# Altium project MOWER_BDC.PRJPCB
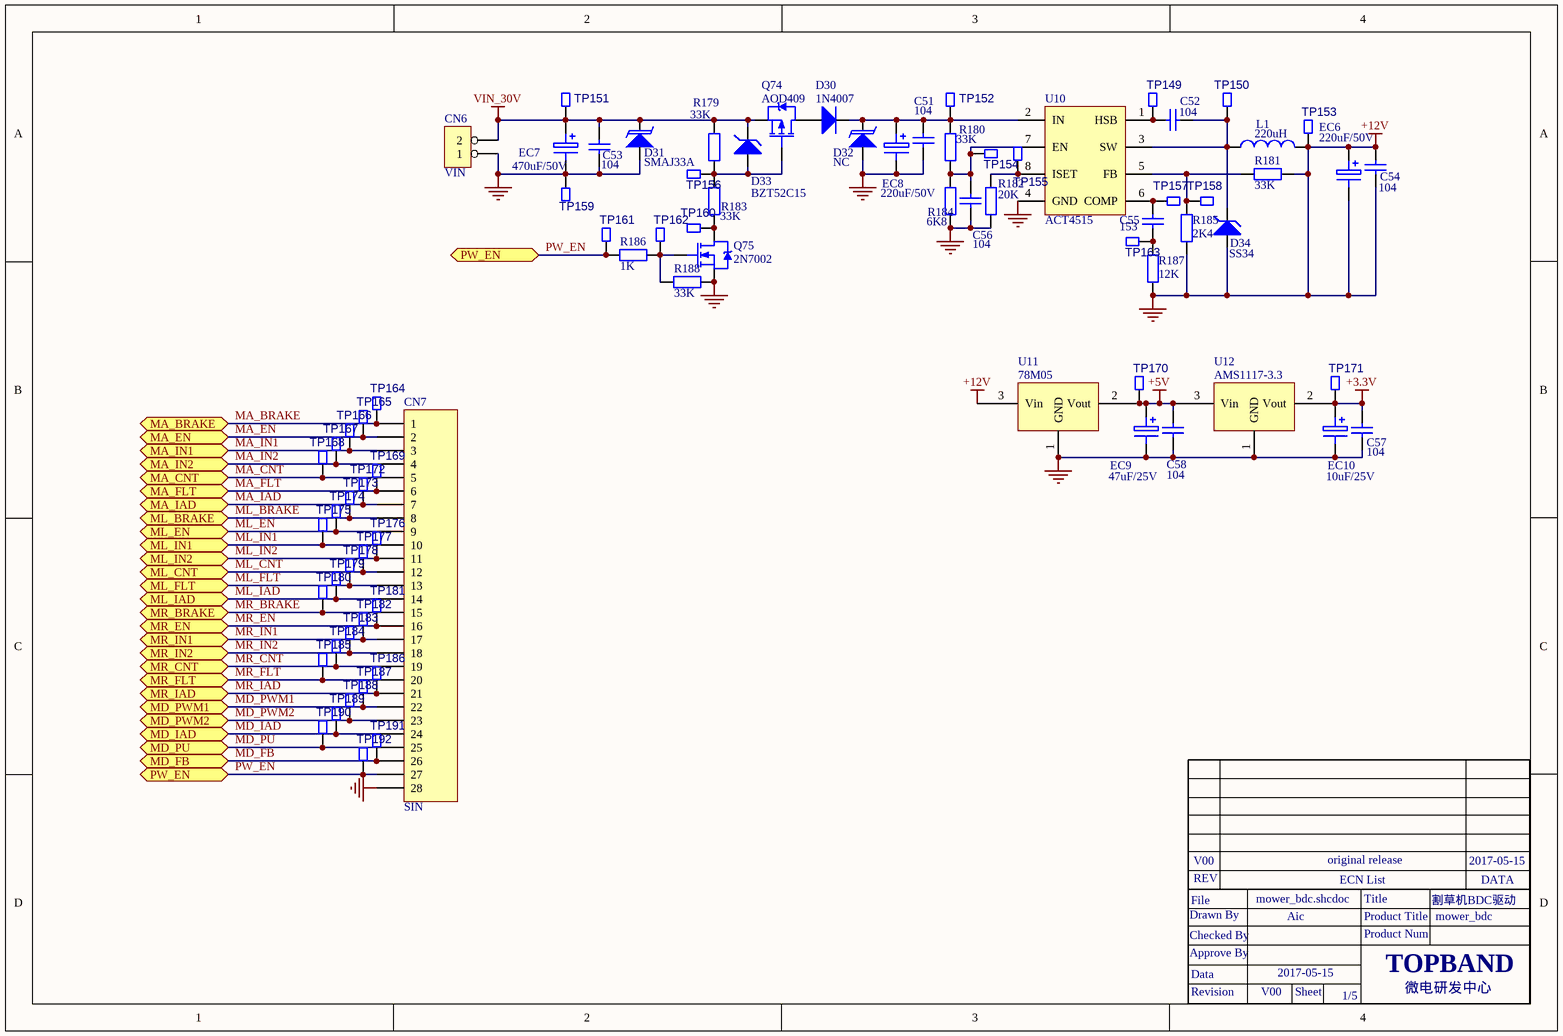
[diagram p0: mower_bdc.SchDoc]
5 sheets, 583 parts. Net scope: flat (ports and power ports of the same name join across sheets).
Sheets:
  mower_bdc.SchDoc
  mc_ma.SchDoc
  mc_wl.SchDoc
  mc_wr.SchDoc
  mc_ds.SchDoc

## Sheet mower_bdc.SchDoc
size A4

### Parts
C51  104  [0603C]
C52  104  [0603C]
C53  104  [0805C]
C54  104  [0603C]
C55  153  [0603C]
C56  104  [0603C]
C57  104  [0603C]
C58  104  [0603C]
CN6  VIN  [CON2-3.96]
CN7  SIN  [CON2.54-2*14]
D30  1N4007  [SMA]
D31  SMAJ33A  [DO-214AC]
D32  NC  [SOD-123]
D33  BZT52C15  [SOD-123]
D34  SS34  [SMA]
EC6  220uF/50V  [EC10]
EC7  470uF/50V  [EC12.5]
EC8  220uF/50V  [EC10]
EC9  47uF/25V  [EC5]
EC10  10uF/25V  [EC4]
L1  220uH  [150700618]
Q74  AOD409  [D-PACK-GDS]
Q75  2N7002  [SOT23-GDS]
R179  33K  [0603R]
R180  33K  [0603R]
R181  33K  [0603R]
R182  20K  [0603R]
R183  33K  [0603R]
R184  6K8  [0603R]
R185  2K4  [0603R]
R186  1K  [0603R]
R187  12K  [0603R]
R188  33K  [0603R]
TP149  TP  [TEST-0.8MM]  (value not drawn)
TP150  TP  [TEST-0.8MM]  (value not drawn)
TP151  TP  [TEST-0.8MM]  (value not drawn)
TP152  TP  [TEST-0.8MM]  (value not drawn)
TP153  TP  [TEST-0.8MM]  (value not drawn)
TP154  TP  [TEST-0.8MM]  (value not drawn)
TP155  TP  [TEST-0.8MM]  (value not drawn)
TP156  TP  [TEST-0.8MM]  (value not drawn)
TP157  TP  [TEST-0.8MM]  (value not drawn)
TP158  TP  [TEST-0.8MM]  (value not drawn)
TP159  TP  [TEST-0.8MM]  (value not drawn)
TP160  TP  [TEST-0.8MM]  (value not drawn)
TP161  TP  [TEST-0.8MM]  (value not drawn)
TP162  TP  [TEST-0.8MM]  (value not drawn)
TP163  TP  [TEST-0.8MM]  (value not drawn)
TP164  TP  [TEST-0.8MM]  (value not drawn)
TP165  TP  [TEST-0.8MM]  (value not drawn)
TP166  TP  [TEST-0.8MM]  (value not drawn)
TP167  TP  [TEST-0.8MM]  (value not drawn)
TP168  TP  [TEST-0.8MM]  (value not drawn)
TP169  TP  [TEST-0.8MM]  (value not drawn)
TP170  TP  [TEST-0.8MM]  (value not drawn)
TP171  TP  [TEST-0.8MM]  (value not drawn)
TP172  TP  [TEST-0.8MM]  (value not drawn)
TP173  TP  [TEST-0.8MM]  (value not drawn)
TP174  TP  [TEST-0.8MM]  (value not drawn)
TP175  TP  [TEST-0.8MM]  (value not drawn)
TP176  TP  [TEST-0.8MM]  (value not drawn)
TP177  TP  [TEST-0.8MM]  (value not drawn)
TP178  TP  [TEST-0.8MM]  (value not drawn)
TP179  TP  [TEST-0.8MM]  (value not drawn)
TP180  TP  [TEST-0.8MM]  (value not drawn)
TP181  TP  [TEST-0.8MM]  (value not drawn)
TP182  TP  [TEST-0.8MM]  (value not drawn)
TP183  TP  [TEST-0.8MM]  (value not drawn)
TP184  TP  [TEST-0.8MM]  (value not drawn)
TP185  TP  [TEST-0.8MM]  (value not drawn)
TP186  TP  [TEST-0.8MM]  (value not drawn)
TP187  TP  [TEST-0.8MM]  (value not drawn)
TP188  TP  [TEST-0.8MM]  (value not drawn)
TP189  TP  [TEST-0.8MM]  (value not drawn)
TP190  TP  [TEST-0.8MM]  (value not drawn)
TP191  TP  [TEST-0.8MM]  (value not drawn)
TP192  TP  [TEST-0.8MM]  (value not drawn)
U10  ACT4515  [SOP-8]
U11  78M05  [D-PACK]
U12  AMS1117-3.3  [SOT-223]

### Ports
MA_BRAKE, MA_CNT, MA_EN, MA_FLT, MA_IAD, MA_IN1, MA_IN2, MD_FB, MD_IAD, MD_PU, MD_PWM1, MD_PWM2, ML_BRAKE, ML_CNT, ML_EN, ML_FLT, ML_IAD, ML_IN1, ML_IN2, MR_BRAKE, MR_CNT, MR_EN, MR_FLT, MR_IAD, MR_IN1, MR_IN2, PW_EN

### Nets
+3.3V: C57.1 EC10.1 TP171.1 U12.2(Vout)
+5V: C58.1 EC9.1 TP170.1 U11.2(Vout) U12.3(Vin)
+12V: C51.2 C53.1 C54.1 C54.2 C56.2 C57.2 C58.2 CN6.1 CN7.28 D31.A D32.A D34.A EC6.1 EC6.2 EC7.2 EC8.2 EC9.2 EC10.2 L1.2 Q75.S R181.1 R182.2 R184.2 R185.1 R187.1 R188.2 TP153.1 TP159.1 U10.4(GND) U11.1(GND) U11.3(Vin) U12.1(GND)  [also labelled GND]
VIN_30V: C53.2 CN6.2 D31.K D33.K EC7.1 Q74.S R179.2 TP151.1
MA_BRAKE: CN7.1 TP164.1 ; port MA_BRAKE
MA_CNT: CN7.5 TP168.1 ; port MA_CNT
MA_EN: CN7.2 TP165.1 ; port MA_EN
MA_FLT: CN7.6 TP169.1 ; port MA_FLT
MA_IAD: CN7.7 TP172.1 ; port MA_IAD
MA_IN1: CN7.3 TP166.1 ; port MA_IN1
MA_IN2: CN7.4 TP167.1 ; port MA_IN2
MD_FB: CN7.26 TP191.1 ; port MD_FB
MD_IAD: CN7.24 TP189.1 ; port MD_IAD
MD_PU: CN7.25 TP190.1 ; port MD_PU
MD_PWM1: CN7.22 TP187.1 ; port MD_PWM1
MD_PWM2: CN7.23 TP188.1 ; port MD_PWM2
ML_BRAKE: CN7.8 TP173.1 ; port ML_BRAKE
ML_CNT: CN7.12 TP177.1 ; port ML_CNT
ML_EN: CN7.9 TP174.1 ; port ML_EN
ML_FLT: CN7.13 TP178.1 ; port ML_FLT
ML_IAD: CN7.14 TP179.1 ; port ML_IAD
ML_IN1: CN7.10 TP175.1 ; port ML_IN1
ML_IN2: CN7.11 TP176.1 ; port ML_IN2
MR_BRAKE: CN7.15 TP180.1 ; port MR_BRAKE
MR_CNT: CN7.19 TP184.1 ; port MR_CNT
MR_EN: CN7.16 TP181.1 ; port MR_EN
MR_FLT: CN7.20 TP185.1 ; port MR_FLT
MR_IAD: CN7.21 TP186.1 ; port MR_IAD
MR_IN1: CN7.17 TP182.1 ; port MR_IN1
MR_IN2: CN7.18 TP183.1 ; port MR_IN2
PW_EN: CN7.27 R186.1 TP161.1 TP192.1 ; port PW_EN
NetC51_1: C51.1 D30.K D32.K EC8.1 R180.1 TP152.1 U10.2(IN)
NetC52_1: C52.1 TP149.1 U10.1(HSB)
NetC52_2: C52.2 D34.K L1.1 TP150.1 U10.3(SW)
NetC55_1: C55.1 TP157.1 U10.6(COMP)
NetC55_2: C55.2 R187.2 TP163.1
NetC56_1: C56.1 R180.2 R184.1 TP154.1 U10.7(EN)
NetD30_A: D30.A Q74.D
NetD33_A: D33.A Q74.G R179.1 R183.1 TP156.1
NetQ75_D: Q75.D R183.2 TP160.1
NetQ75_G: Q75.G R186.2 R188.1 TP162.1
NetR181_2: R181.2 R185.2 TP158.1 U10.5(FB)
NetR182_1: R182.1 TP155.1 U10.8(ISET)

### Notes on the sheet
- Drawn By
- File
- REV
- V00
- mower_bdc.shcdoc
- Aic
- original release
- ECN List
- Product Title
- Title
- 割草机BDC驱动
- mower_bdc
- 2017-05-15
- DATA
- Approve By
- Checked By
- Data
- Product Num
- TOPBAND
- Revision
- Sheet
- 1/5
- 微电研发中心

### Library data of the parts
C51-C58 = Cap(0603): Component Kind: standard; Component Type: standard
CN6 = 2Pin(卧式): 插座; U_TABLE: U_SAM01021601; id: 20; Part Number: 2Pin(卧式); Component Kind: Standard; Component Type: Standard; Designator: 2Pin(卧式); Footprint: CON2-2.54卧式; Pin Count: 2
CN7 = CON28
D30 = Diode(DO-35)-D: 二极管; U_TABLE: U_SAM010203; id: 32; Part Number: Diode(DO-35)-D; Component Kind: standard; Component Type: standard; Pin Count: 2
D31 = Diode(TVS_贴片)_1: 120301346; U_TABLE: U_SAM010203; id: 28; Description: TVS管; Part Number: Diode(TVS_贴片)_1; Component Kind: standard; Component Type: standard; Pin Count: 2
D32 = Diode(TVS_贴片)_1: TVS管; U_TABLE: U_SAM010203; id: 28; Part Number: Diode(TVS_贴片)_1; Component Kind: standard; Component Type: standard; Pin Count: 2
D33 D34 = D Zener(贴片): 120301465; U_TABLE: U_SAM010203; id: 25; Description: 稳压二极管; Part Number: D Zener(贴片); Component Kind: standard; Component Type: standard; Pin Count: 2
EC6 EC8-EC10 = Electro(2.5mm): 电解电容; U_TABLE: U_SAM010202; id: 42; Part Number: Electro(2.5mm); Component Kind: standard; Component Type: standard; Pin Count: 2
EC7 = Electro(2.5mm): 150200079; U_TABLE: U_SAM010202; id: 42; Description: 电解电容; Part Number: Electro(2.5mm); Component Kind: standard; Component Type: standard; Pin Count: 2
L1 = Inductor(0805): 150700618; U_TABLE: U_SAM010207; id: 140; Description: 电感; Part Number: Inductor(0805); Component Kind: standard; Component Type: standard
Q74 = PMOS-2: MOS管; U_TABLE: U_SAM010204; id: 19; Part Number: PMOS-2; Component Kind: standard; Component Type: standard; Pin Count: 3
Q75 = NMOS-2: MOS管; U_TABLE: U_SAM010204; id: 17; Part Number: NMOS-2; Component Kind: standard; Component Type: standard; Pin Count: 3
R179-R185 R187 R188 = Res2: Resistor; Value: 1K; 物料编码: 150103083; Published: 8-Jun-2000; LatestRevisionDate: 17-Jul-2002; LatestRevisionNote: Re-released for DXP Platform.; PackageReference: AXIAL-0.4; Publisher: Altium Limited
R186 = Res2: Resistor; 物料编码: 150103083; Published: 8-Jun-2000; LatestRevisionDate: 17-Jul-2002; LatestRevisionNote: Re-released for DXP Platform.; PackageReference: AXIAL-0.4; Publisher: Altium Limited; Value: 1K
U11 = AMS1117-3.3

## Sheet mc_ma.SchDoc
size A4
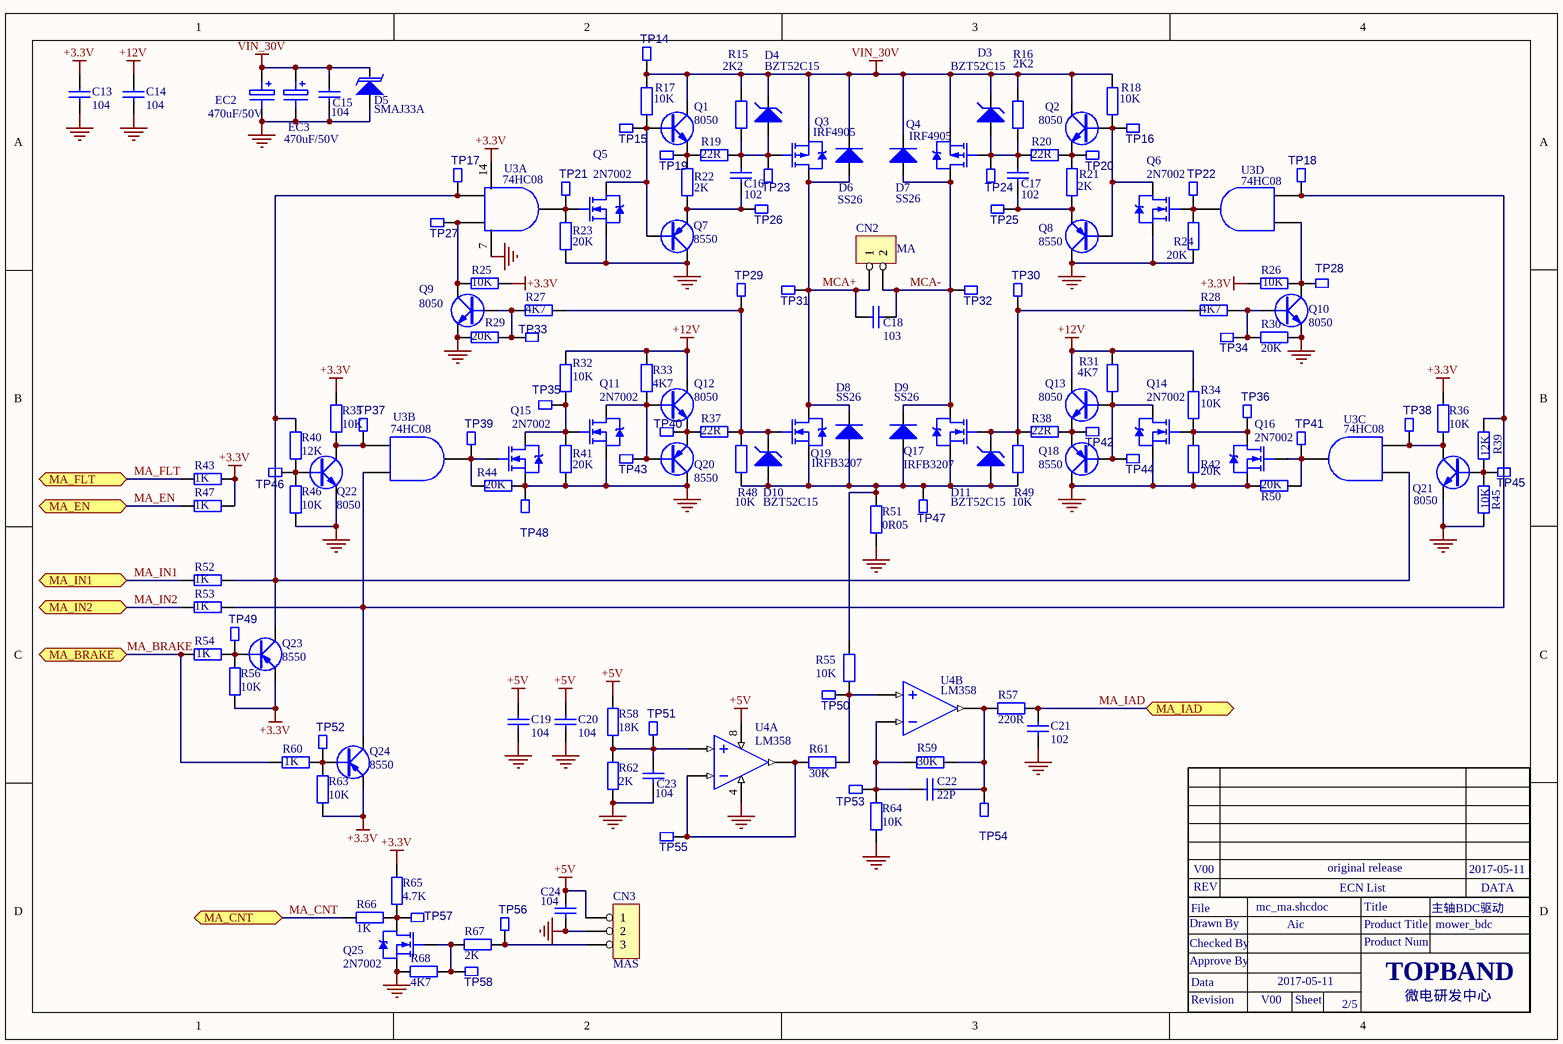
[diagram p1: mc_ma.SchDoc]

### Parts
C13  104  [0603C]
C14  104  [0603C]
C15  104  [0805C]
C16  102  [0805C]
C17  102  [0805C]
C18  103  [1206C]
C19  104  [0603C]
C20  104  [0603C]
C21  102  [0603C]
C22  22P  [0603C]
C23  104  [0603C]
C24  104  [0603C]
CN2  MA  [CON2-3.96]
CN3  MAS  [CON3-2.54]
D3  BZT52C15  [SOD-123]
D4  BZT52C15  [SOD-123]
D5  SMAJ33A  [DO-214AC]
D6  SS26  [SMB]
D7  SS26  [SMB]
D8  SS26  [SMB]
D9  SS26  [SMB]
D10  BZT52C15  [SOD-123]
D11  BZT52C15  [SOD-123]
EC2  470uF/50V  [EC12.5]
EC3  470uF/50V  [EC12.5]
Q1  8050  [SOT-23-BCE]
Q2  8050  [SOT-23-BCE]
Q3  IRF4905  [TO-220-GDS]
Q4  IRF4905  [TO-220-GDS]
Q5  2N7002  [SOT-23-GDS]
Q6  2N7002  [SOT-23-GDS]
Q7  8550  [SOT-23-BCE]
Q8  8550  [SOT-23-BCE]
Q9  8050  [SOT-23-BCE]
Q10  8050  [SOT-23-BCE]
Q11  2N7002  [SOT-23-GDS]
Q12  8050  [SOT-23-BCE]
Q13  8050  [SOT-23-BCE]
Q14  2N7002  [SOT-23-GDS]
Q15  2N7002  [SOT-23-GDS]
Q16  2N7002  [SOT-23-GDS]
Q17  IRFB3207  [TO-220-GDS]
Q18  8550  [SOT-23-BCE]
Q19  IRFB3207  [TO-220-GDS]
Q20  8550  [SOT-23-BCE]
Q21  8050  [SOT-23-BCE]
Q22  8050  [SOT-23-BCE]
Q23  8550  [SOT-23-BCE]
Q24  8550  [SOT-23-BCE]
Q25  2N7002  [SOT-23-GDS]
R15  2K2  [0805R]
R16  2K2  [0805R]
R17  10K  [0603R]
R18  10K  [0603R]
R19  22R  [0805R]
R20  22R  [0805R]
R21  2K  [0805R]
R22  2K  [0805R]
R23  20K  [0603R]
R24  20K  [0603R]
R25  10K  [0603R]
R26  10K  [0603R]
R27  4K7  [0603R]
R28  4K7  [0603R]
R29  20K  [0603R]
R30  20K  [0603R]
R31  4K7  [0603R]
R32  10K  [0603R]
R33  4K7  [0603R]
R34  10K  [0603R]
R35  10K  [0603R]
R36  10K  [0603R]
R37  22R  [0805R]
R38  22R  [0805R]
R39  12K  [0603R]
R40  12K  [0603R]
R41  20K  [0603R]
R42  20K  [0603R]
R43  1K  [0603R]
R44  20K  [0603R]
R45  10K  [0603R]
R46  10K  [0603R]
R47  1K  [0603R]
R48  10K  [0603R]
R49  10K  [0603R]
R50  20K  [0603R]
R51  0R05  [2512R]
R52  1K  [0603R]
R53  1K  [0603R]
R54  1K  [0603R]
R55  10K  [0603R]
R56  10K  [0603R]
R57  220R  [0603R]
R58  18K  [0603R]
R59  30K  [0603R]
R60  1K  [0603R]
R61  30K  [0603R]
R62  2K  [0603R]
R63  10K  [0603R]
R64  10K  [0603R]
R65  4.7K  [0603R]
R66  1K  [0603R]
R67  2K  [0603R]
R68  4K7  [0603R]
TP14  TP  [TEST-0.8MM]  (value not drawn)
TP15  TP  [TEST-0.8MM]  (value not drawn)
TP16  TP  [TEST-0.8MM]  (value not drawn)
TP17  TP  [TEST-0.8MM]  (value not drawn)
TP18  TP  [TEST-0.8MM]  (value not drawn)
TP19  TP  [TEST-0.8MM]  (value not drawn)
TP20  TP  [TEST-0.8MM]  (value not drawn)
TP21  TP  [TEST-0.8MM]  (value not drawn)
TP22  TP  [TEST-0.8MM]  (value not drawn)
TP23  TP  [TEST-0.8MM]  (value not drawn)
TP24  TP  [TEST-0.8MM]  (value not drawn)
TP25  TP  [TEST-0.8MM]  (value not drawn)
TP26  TP  [TEST-0.8MM]  (value not drawn)
TP27  TP  [TEST-0.8MM]  (value not drawn)
TP28  TP  [TEST-0.8MM]  (value not drawn)
TP29  TP  [TEST-0.8MM]  (value not drawn)
TP30  TP  [TEST-0.8MM]  (value not drawn)
TP31  TP  [TEST-0.8MM]  (value not drawn)
TP32  TP  [TEST-0.8MM]  (value not drawn)
TP33  TP  [TEST-0.8MM]  (value not drawn)
TP34  TP  [TEST-0.8MM]  (value not drawn)
TP35  TP  [TEST-0.8MM]  (value not drawn)
TP36  TP  [TEST-0.8MM]  (value not drawn)
TP37  TP  [TEST-0.8MM]  (value not drawn)
TP38  TP  [TEST-0.8MM]  (value not drawn)
TP39  TP  [TEST-0.8MM]  (value not drawn)
TP40  TP  [TEST-0.8MM]  (value not drawn)
TP41  TP  [TEST-0.8MM]  (value not drawn)
TP42  TP  [TEST-0.8MM]  (value not drawn)
TP43  TP  [TEST-0.8MM]  (value not drawn)
TP44  TP  [TEST-0.8MM]  (value not drawn)
TP45  TP  [TEST-0.8MM]  (value not drawn)
TP46  TP  [TEST-0.8MM]  (value not drawn)
TP47  TP  [TEST-0.8MM]  (value not drawn)
TP48  TP  [TEST-0.8MM]  (value not drawn)
TP49  TP  [TEST-0.8MM]  (value not drawn)
TP50  TP  [TEST-0.8MM]  (value not drawn)
TP51  TP  [TEST-0.8MM]  (value not drawn)
TP52  TP  [TEST-0.8MM]  (value not drawn)
TP53  TP  [TEST-0.8MM]  (value not drawn)
TP54  TP  [TEST-0.8MM]  (value not drawn)
TP55  TP  [TEST-0.8MM]  (value not drawn)
TP56  TP  [TEST-0.8MM]  (value not drawn)
TP57  TP  [TEST-0.8MM]  (value not drawn)
TP58  TP  [TEST-0.8MM]  (value not drawn)
U3  74HC08  [SO-14]  (parts A,B,C,D of 4)
U4  LM358  [SO-8]  (parts A,B of 2)

### Ports
MA_BRAKE, MA_CNT, MA_EN, MA_FLT, MA_IAD, MA_IN1, MA_IN2

### Nets
+3.3V: C13.2 Q23.E Q24.E R25.2 R26.1 R35.1 R36.2 R43.2 R47.2 R56.2 R63.2 R65.2 U3.14(VCC)
+5V: C19.2 C20.2 C24.2 CN3.1 R58.2 U4.8(VCC)
+12V: C13.1 C14.1 C14.2 C15.1 C19.1 C20.1 C21.2 C23.1 C24.1 CN3.2 D5.A EC2.2 EC3.2 Q5.S Q6.S Q7.C Q8.C Q9.E Q10.E Q11.S Q12.C Q13.C Q14.S Q15.S Q16.S Q18.C Q20.C Q21.E Q22.E Q25.S R23.2 R24.1 R29.1 R30.2 R31.1 R32.2 R33.2 R34.2 R41.2 R42.2 R44.2 R45.1 R46.1 R50.1 R51.1 R62.1 R64.1 R68.1 TP48.1 U3.7(GND) U4.4(GND)  [also labelled GND]
VIN_30V: C15.2 D3.K D4.K D5.K D6.K D7.K EC2.1 EC3.1 Q1.C Q2.C Q3.S Q4.S R15.1 R16.1 R17.1 R18.1 TP14.1
MA_BRAKE: R54.2 R60.2 ; port MA_BRAKE
MA_CNT: R66.1 ; port MA_CNT
MA_EN: R47.1 ; port MA_EN
MA_FLT: R43.1 ; port MA_FLT
MA_IAD: C21.1 R57.2 ; port MA_IAD
MA_IN1: R52.1 ; port MA_IN1
MA_IN2: R53.1 ; port MA_IN2
MCA+: C18.1 CN2.1 D6.A D8.K Q3.D Q19.D TP31.1
MCA-: C18.2 CN2.2 D7.A D9.K Q4.D Q17.D TP32.1
NetC16_1: C16.1 D4.A Q3.G R15.2 R19.2 TP23.1
NetC16_2: C16.2 Q7.E R22.2 TP26.1
NetC17_1: C17.1 D3.A Q4.G R16.2 R20.1 TP24.1
NetC17_2: C17.2 Q8.E R21.2 TP25.1
NetC22_1: C22.1 R57.1 R59.1 TP54.1 U4.1(OUT2)
NetC22_2: C22.2 R59.2 R64.2 TP53.1 U4.2(-IN2)
NetC23_2: C23.2 R58.1 R62.2 TP51.1 U4.5(+IN1)
NetCN3_3: CN3.3 R67.1 TP56.1
NetD8_A: D8.A D9.A D10.A D11.A Q17.S Q19.S R48.1 R49.1 R51.2 R55.1 TP47.1
NetD10_K: D10.K Q19.G R27.2 R37.2 R48.2 TP29.1
NetD11_K: D11.K Q17.G R28.1 R38.1 R49.2 TP30.1
NetQ1_B: Q1.B Q5.D Q7.B R17.2 TP15.1
NetQ1_E: Q1.E R19.1 R22.1 TP19.1
NetQ2_B: Q2.B Q6.D Q8.B R18.2 TP16.1
NetQ2_E: Q2.E R20.2 R21.1 TP20.1
NetQ5_G: Q5.G R23.1 TP21.1 U3.3(1Y)
NetQ6_G: Q6.G R24.2 TP22.1 U3.11(4Y)
NetQ9_B: Q9.B R27.1 R29.2 TP33.1
NetQ9_C: Q9.C R25.1 TP27.1 U3.2(1B)
NetQ10_B: Q10.B R28.2 R30.1 TP34.1
NetQ10_C: Q10.C R26.2 TP28.1 U3.12(4A)
NetQ11_D: Q11.D Q12.B Q20.B R33.1 TP43.1
NetQ11_G: Q11.G Q15.D R32.1 R41.1 TP35.1
NetQ12_E: Q12.E Q20.E R37.1 TP40.1
NetQ13_B: Q13.B Q14.D Q18.B R31.2 TP44.1
NetQ13_E: Q13.E Q18.E R38.2 TP42.1
NetQ14_G: Q14.G Q16.D R34.1 R42.1 TP36.1
NetQ15_G: Q15.G R44.1 TP39.1 U3.6(2Y)
NetQ16_G: Q16.G R50.2 TP41.1 U3.8(3Y)
NetQ21_B: Q21.B R39.1 R45.2 TP45.1
NetQ21_C: Q21.C R36.1 TP38.1 U3.10(3B)
NetQ22_B: Q22.B R40.2 R46.2 TP46.1
NetQ22_C: Q22.C R35.2 TP37.1 U3.4(2A)
NetQ23_B: Q23.B R54.1 R56.1 TP49.1
NetQ23_C: Q23.C R40.1 R52.2 TP17.1 U3.1(1A) U3.9(3A)
NetQ24_B: Q24.B R60.1 R63.1 TP52.1
NetQ24_C: Q24.C R39.2 R53.2 TP18.1 U3.5(2B) U3.13(4B)
NetQ25_D: Q25.D R65.1 R66.2 TP57.1
NetQ25_G: Q25.G R67.2 R68.2 TP58.1
NetR55_2: R55.2 R61.2 TP50.1 U4.3(IN2+)
NetR61_1: R61.1 TP55.1 U4.6(-IN1) U4.7(OUT1)

### Notes on the sheet
- Drawn By
- File
- REV
- V00
- mc_ma.shcdoc
- Aic
- original release
- ECN List
- Product Title
- Title
- 主轴BDC驱动
- mower_bdc
- 2017-05-11
- DATA
- Approve By
- Checked By
- Data
- Product Num
- TOPBAND
- Revision
- Sheet
- 2/5
- 微电研发中心

### Library data of the parts
C13-C24 = Cap(0603): Component Kind: standard; Component Type: standard
CN2 = 2Pin(卧式): 插座; U_TABLE: U_SAM01021601; id: 20; Part Number: 2Pin(卧式); Component Kind: Standard; Component Type: Standard; Designator: 2Pin(卧式); Footprint: CON2-2.54卧式; Pin Count: 2
CN3 = 3Pin(卧式): 插座; U_TABLE: U_SAM01021601; id: 26; Part Number: 3Pin(卧式); Component Kind: standard; Component Type: standard; Designator: 3Pin(卧式); Footprint: CON3-2.54卧式; Pin Count: 3
D3 D4 D10 D11 = D Zener(贴片): 120301303; U_TABLE: U_SAM010203; id: 25; Description: 稳压二极管; Part Number: D Zener(贴片); Component Kind: standard; Component Type: standard; Pin Count: 2
D5 = Diode(TVS_贴片)_1: as D31 on sheet mower_bdc; Part Number: Diode(TVS_贴片)_1; Component Kind: standard; Component Type: standard; Pin Count: 2
D6-D9 = Diode(DO-35)-D: 二极管; U_TABLE: U_SAM010203; id: 32; Part Number: Diode(DO-35)-D; Component Kind: standard; Component Type: standard; Pin Count: 2
EC2 EC3 = Electro(2.5mm): as EC7 on sheet mower_bdc; Part Number: Electro(2.5mm); Component Kind: standard; Component Type: standard; Pin Count: 2
Q1 Q2 Q9 Q10 Q12 Q13 Q21 Q22 = NPN(贴片): 三极管; U_TABLE: U_SAM010204; id: 18; Part Number: NPN(贴片); Component Kind: standard; Component Type: standard; Pin Count: 3
Q3 Q4 = PMOS-2: MOS管; U_TABLE: U_SAM010204; id: 19; Part Number: PMOS-2; Component Kind: standard; Component Type: standard; Pin Count: 3
Q5 Q6 Q11 Q14-Q17 Q19 Q25 = NMOS-2: MOS管; U_TABLE: U_SAM010204; id: 17; Part Number: NMOS-2; Component Kind: standard; Component Type: standard; Pin Count: 3
Q7 Q8 Q18 Q20 Q23 Q24 = PNP(贴片): 三极管; U_TABLE: U_SAM010204; id: 20; Part Number: PNP(贴片); Component Kind: standard; Component Type: standard; Pin Count: 3
R15-R42 R44-R46 R48-R51 R65 = Res2: Resistor; Value: 1K; 物料编码: 150103083; Published: 8-Jun-2000; LatestRevisionDate: 17-Jul-2002; LatestRevisionNote: Re-released for DXP Platform.; PackageReference: AXIAL-0.4; Publisher: Altium Limited
R43 R47 R52-R54 R60 = Res2: Resistor; 物料编码: 150103083; Published: 8-Jun-2000; LatestRevisionDate: 17-Jul-2002; LatestRevisionNote: Re-released for DXP Platform.; PackageReference: AXIAL-0.4; Publisher: Altium Limited; Value: 1K
R55 R57 R59 R61 R64 = Res2: Resistor; Value: 1K; Published: 8-Jun-2000; LatestRevisionDate: 17-Jul-2002; LatestRevisionNote: Re-released for DXP Platform.; PackageReference: AXIAL-0.4; Publisher: Altium Limited
R56 R58 R62 R63 R66-R68 = Res2: Resistor; Published: 8-Jun-2000; LatestRevisionDate: 17-Jul-2002; LatestRevisionNote: Re-released for DXP Platform.; PackageReference: AXIAL-0.4; Publisher: Altium Limited
U4 = IC_LM358: 121000225; U_TABLE: U_SAM010210; Description: 集成电路; id: 83; U_ITEM_ID（物料编码）: 121000100; U_100114（SAP物料描述）: SMT运放LM358_SO-8_TI_环保; U_100047（环保属性）: 环保; U_100107（工厂BOM使用频率）: 1000:1;1500:12;3000:7;5000:14;; U_100105（工厂库存）: 1000:7508.000;1500:160.000;2000:0.000;3000:485.000;5000:1542.000;; U_100117（工厂采购量）: 1000:7500.000;1500:300.000;3000:2500.000;5000:7500.000;; Part Number: IC_LM358; Component Kind: standard; Component Type: standard; Designator: IC_LM358; Footprint: DIP14; Pin Count: 8; U_100076（型号）: LM358; U_100040（封装方式）: SO-8; U_100086（指定供应商）: TI

## Sheet mc_wl.SchDoc
size A4
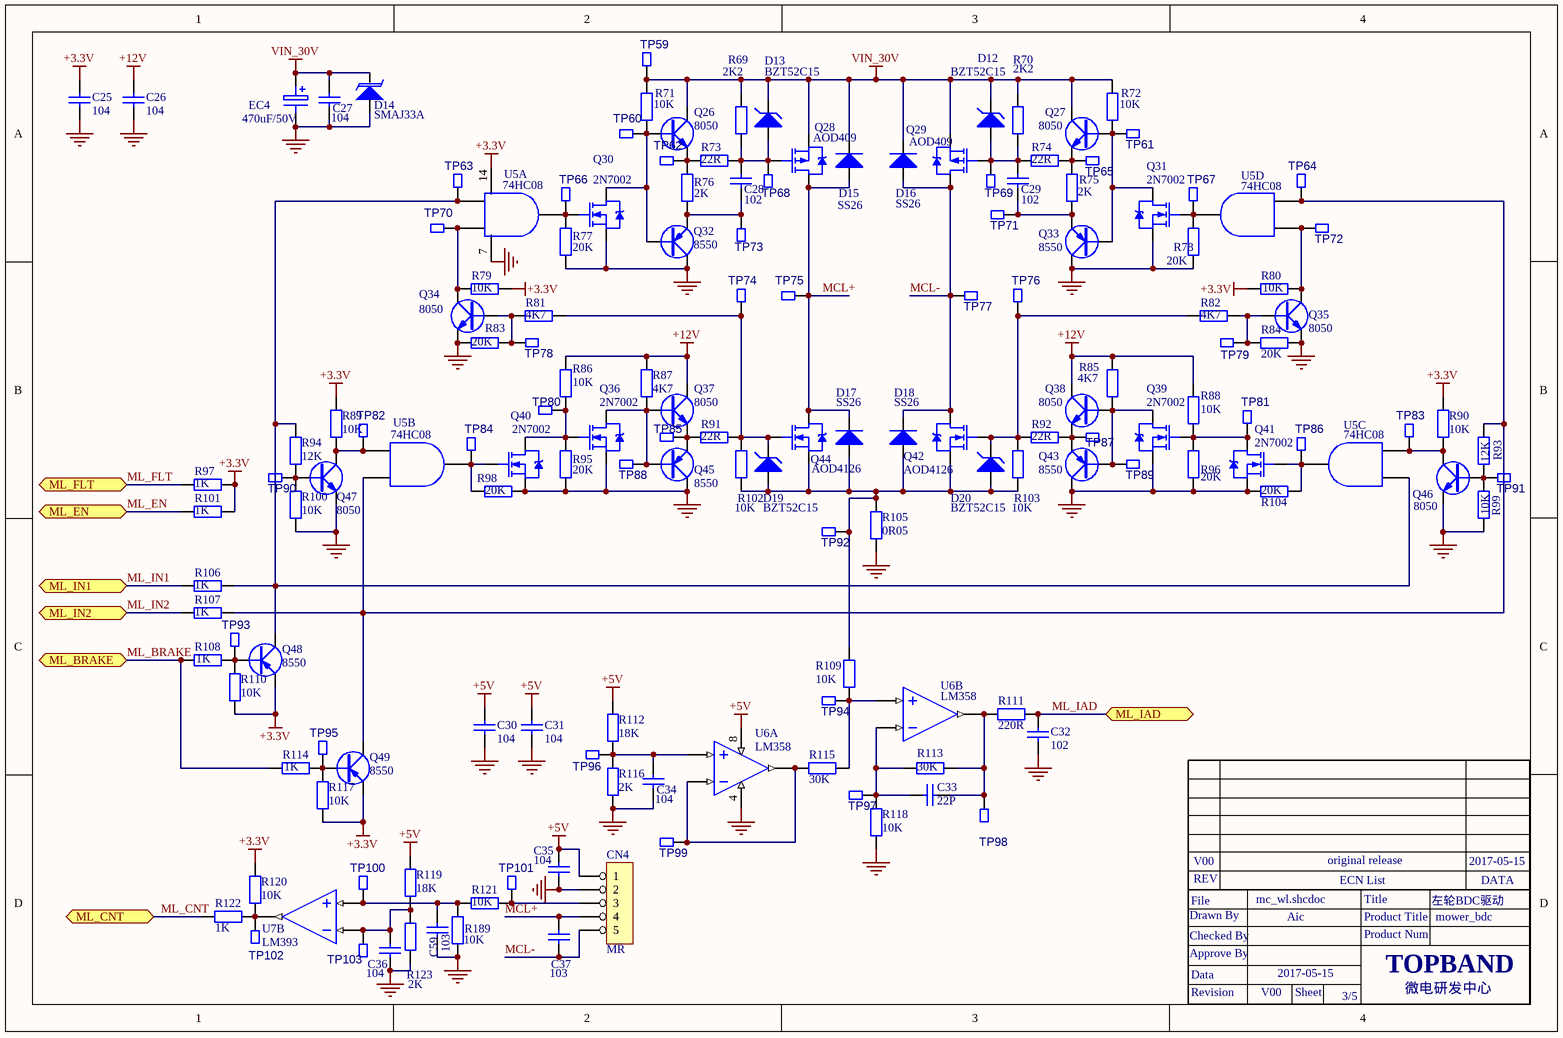
[diagram p2: mc_wl.SchDoc]

### Parts
C25  104  [0603C]
C26  104  [0603C]
C27  104  [0805C]
C28  102  [0805C]
C29  102  [0805C]
C30  104  [0603C]
C31  104  [0603C]
C32  102  [0603C]
C33  22P  [0603C]
C34  104  [0603C]
C35  104  [0603C]
C36  104  [0603C]
C37  103  [1206C]
C59  103  [0603C]
CN4  MR  [CON5-2.54]
D12  BZT52C15  [SOD-123]
D13  BZT52C15  [SOD-123]
D14  SMAJ33A  [DO-214AC]
D15  SS26  [SMB]
D16  SS26  [SMB]
D17  SS26  [SMB]
D18  SS26  [SMB]
D19  BZT52C15  [SOD-123]
D20  BZT52C15  [SOD-123]
EC4  470uF/50V  [EC12.5]
Q26  8050  [SOT-23-BCE]
Q27  8050  [SOT-23-BCE]
Q28  AOD409  [D-PACK-GDS]
Q29  AOD409  [D-PACK-GDS]
Q30  2N7002  [SOT-23-GDS]
Q31  2N7002  [SOT-23-GDS]
Q32  8550  [SOT-23-BCE]
Q33  8550  [SOT-23-BCE]
Q34  8050  [SOT-23-BCE]
Q35  8050  [SOT-23-BCE]
Q36  2N7002  [SOT-23-GDS]
Q37  8050  [SOT-23-BCE]
Q38  8050  [SOT-23-BCE]
Q39  2N7002  [SOT-23-GDS]
Q40  2N7002  [SOT-23-GDS]
Q41  2N7002  [SOT-23-GDS]
Q42  AOD4126  [D-PACK-GDS]
Q43  8550  [SOT-23-BCE]
Q44  AOD4126  [D-PACK-GDS]
Q45  8550  [SOT-23-BCE]
Q46  8050  [SOT-23-BCE]
Q47  8050  [SOT-23-BCE]
Q48  8550  [SOT-23-BCE]
Q49  8550  [SOT-23-BCE]
R69  2K2  [0805R]
R70  2K2  [0805R]
R71  10K  [0603R]
R72  10K  [0603R]
R73  22R  [0805R]
R74  22R  [0805R]
R75  2K  [0805R]
R76  2K  [0805R]
R77  20K  [0603R]
R78  20K  [0603R]
R79  10K  [0603R]
R80  10K  [0603R]
R81  4K7  [0603R]
R82  4K7  [0603R]
R83  20K  [0603R]
R84  20K  [0603R]
R85  4K7  [0603R]
R86  10K  [0603R]
R87  4K7  [0603R]
R88  10K  [0603R]
R89  10K  [0603R]
R90  10K  [0603R]
R91  22R  [0805R]
R92  22R  [0805R]
R93  12K  [0603R]
R94  12K  [0603R]
R95  20K  [0603R]
R96  20K  [0603R]
R97  1K  [0603R]
R98  20K  [0603R]
R99  10K  [0603R]
R100  10K  [0603R]
R101  1K  [0603R]
R102  10K  [0603R]
R103  10K  [0603R]
R104  20K  [0603R]
R105  0R05  [2512R]
R106  1K  [0603R]
R107  1K  [0603R]
R108  1K  [0603R]
R109  10K  [0603R]
R110  10K  [0603R]
R111  220R  [0603R]
R112  18K  [0603R]
R113  30K  [0603R]
R114  1K  [0603R]
R115  30K  [0603R]
R116  2K  [0603R]
R117  10K  [0603R]
R118  10K  [0603R]
R119  18K  [0603R]
R120  10K  [0603R]
R121  10K  [0603R]
R122  1K  [0603R]
R123  2K  [0603R]
R189  10K  [0603R]
TP59  TP  [TEST-0.8MM]  (value not drawn)
TP60  TP  [TEST-0.8MM]  (value not drawn)
TP61  TP  [TEST-0.8MM]  (value not drawn)
TP62  TP  [TEST-0.8MM]  (value not drawn)
TP63  TP  [TEST-0.8MM]  (value not drawn)
TP64  TP  [TEST-0.8MM]  (value not drawn)
TP65  TP  [TEST-0.8MM]  (value not drawn)
TP66  TP  [TEST-0.8MM]  (value not drawn)
TP67  TP  [TEST-0.8MM]  (value not drawn)
TP68  TP  [TEST-0.8MM]  (value not drawn)
TP69  TP  [TEST-0.8MM]  (value not drawn)
TP70  TP  [TEST-0.8MM]  (value not drawn)
TP71  TP  [TEST-0.8MM]  (value not drawn)
TP72  TP  [TEST-0.8MM]  (value not drawn)
TP73  TP  [TEST-0.8MM]  (value not drawn)
TP74  TP  [TEST-0.8MM]  (value not drawn)
TP75  TP  [TEST-0.8MM]  (value not drawn)
TP76  TP  [TEST-0.8MM]  (value not drawn)
TP77  TP  [TEST-0.8MM]  (value not drawn)
TP78  TP  [TEST-0.8MM]  (value not drawn)
TP79  TP  [TEST-0.8MM]  (value not drawn)
TP80  TP  [TEST-0.8MM]  (value not drawn)
TP81  TP  [TEST-0.8MM]  (value not drawn)
TP82  TP  [TEST-0.8MM]  (value not drawn)
TP83  TP  [TEST-0.8MM]  (value not drawn)
TP84  TP  [TEST-0.8MM]  (value not drawn)
TP85  TP  [TEST-0.8MM]  (value not drawn)
TP86  TP  [TEST-0.8MM]  (value not drawn)
TP87  TP  [TEST-0.8MM]  (value not drawn)
TP88  TP  [TEST-0.8MM]  (value not drawn)
TP89  TP  [TEST-0.8MM]  (value not drawn)
TP90  TP  [TEST-0.8MM]  (value not drawn)
TP91  TP  [TEST-0.8MM]  (value not drawn)
TP92  TP  [TEST-0.8MM]  (value not drawn)
TP93  TP  [TEST-0.8MM]  (value not drawn)
TP94  TP  [TEST-0.8MM]  (value not drawn)
TP95  TP  [TEST-0.8MM]  (value not drawn)
TP96  TP  [TEST-0.8MM]  (value not drawn)
TP97  TP  [TEST-0.8MM]  (value not drawn)
TP98  TP  [TEST-0.8MM]  (value not drawn)
TP99  TP  [TEST-0.8MM]  (value not drawn)
TP100  TP  [TEST-0.8MM]  (value not drawn)
TP101  TP  [TEST-0.8MM]  (value not drawn)
TP102  TP  [TEST-0.8MM]  (value not drawn)
TP103  TP  [TEST-0.8MM]  (value not drawn)
U5  74HC08  [SO-14]  (parts A,B,C,D of 4)
U6  LM358  [SO-8]  (parts A,B of 2)
U7  LM393  [SO-8]  (part B of 2)

### Ports
ML_BRAKE, ML_CNT, ML_EN, ML_FLT, ML_IAD, ML_IN1, ML_IN2

### Nets
+3.3V: C25.2 Q48.E Q49.E R79.2 R80.1 R89.1 R90.2 R97.2 R101.2 R110.2 R117.2 R120.2 U5.14(VCC)
+5V: C30.2 C31.2 C35.2 CN4.1 R112.2 R119.2 U6.8(VCC)
+12V: C25.1 C26.1 C26.2 C27.1 C30.1 C31.1 C32.2 C34.1 C35.1 C36.1 C59.1 CN4.2 D14.A EC4.2 Q30.S Q31.S Q32.C Q33.C Q34.E Q35.E Q36.S Q37.C Q38.C Q39.S Q40.S Q41.S Q43.C Q45.C Q46.E Q47.E R77.2 R78.1 R83.1 R84.2 R85.1 R86.2 R87.2 R88.2 R95.2 R96.2 R98.2 R99.1 R100.1 R104.1 R105.1 R116.1 R118.1 R123.1 R189.2 U5.7(GND) U6.4(GND)  [also labelled GND]
VIN_30V: C27.2 D12.K D13.K D14.K D15.K D16.K EC4.1 Q26.C Q27.C Q28.S Q29.S R69.1 R70.1 R71.1 R72.1 TP59.1
MCL+: C37.2 CN4.4 D15.A D17.K Q28.D Q44.D TP75.1
MCL-: C37.1 CN4.5 D16.A D18.K Q29.D Q42.D TP77.1
ML_BRAKE: R108.2 R114.2 ; port ML_BRAKE
ML_CNT: R122.1 ; port ML_CNT
ML_EN: R101.1 ; port ML_EN
ML_FLT: R97.1 ; port ML_FLT
ML_IAD: C32.1 R111.2 ; port ML_IAD
ML_IN1: R106.1 ; port ML_IN1
ML_IN2: R107.1 ; port ML_IN2
NetC28_1: C28.1 D13.A Q28.G R69.2 R73.2 TP68.1
NetC28_2: C28.2 Q32.E R76.2 TP73.1
NetC29_1: C29.1 D12.A Q29.G R70.2 R74.1 TP69.1
NetC29_2: C29.2 Q33.E R75.2 TP71.1
NetC33_1: C33.1 R111.1 R113.1 TP98.1 U6.1(OUT2)
NetC33_2: C33.2 R113.2 R118.2 TP97.1 U6.2(-IN2)
NetC34_2: C34.2 R112.1 R116.2 TP96.1 U6.5(+IN1)
NetC36_2: C36.2 R119.1 R123.2 TP103.1 U7.2(-IN2)
NetC59_2: C59.2 R121.2 R189.1 TP100.1 U7.3(IN2+)
NetCN4_3: CN4.3 R121.1 TP101.1
NetD17_A: D17.A D18.A D19.A D20.A Q42.S Q44.S R102.1 R103.1 R105.2 R109.1 TP92.1
NetD19_K: D19.K Q44.G R81.2 R91.2 R102.2 TP74.1
NetD20_K: D20.K Q42.G R82.1 R92.1 R103.2 TP76.1
NetQ26_B: Q26.B Q30.D Q32.B R71.2 TP60.1
NetQ26_E: Q26.E R73.1 R76.1 TP62.1
NetQ27_B: Q27.B Q31.D Q33.B R72.2 TP61.1
NetQ27_E: Q27.E R74.2 R75.1 TP65.1
NetQ30_G: Q30.G R77.1 TP66.1 U5.3(1Y)
NetQ31_G: Q31.G R78.2 TP67.1 U5.11(4Y)
NetQ34_B: Q34.B R81.1 R83.2 TP78.1
NetQ34_C: Q34.C R79.1 TP70.1 U5.2(1B)
NetQ35_B: Q35.B R82.2 R84.1 TP79.1
NetQ35_C: Q35.C R80.2 TP72.1 U5.12(4A)
NetQ36_D: Q36.D Q37.B Q45.B R87.1 TP88.1
NetQ36_G: Q36.G Q40.D R86.1 R95.1 TP80.1
NetQ37_E: Q37.E Q45.E R91.1 TP85.1
NetQ38_B: Q38.B Q39.D Q43.B R85.2 TP89.1
NetQ38_E: Q38.E Q43.E R92.2 TP87.1
NetQ39_G: Q39.G Q41.D R88.1 R96.1 TP81.1
NetQ40_G: Q40.G R98.1 TP84.1 U5.6(2Y)
NetQ41_G: Q41.G R104.2 TP86.1 U5.8(3Y)
NetQ46_B: Q46.B R93.1 R99.2 TP91.1
NetQ46_C: Q46.C R90.1 TP83.1 U5.10(3B)
NetQ47_B: Q47.B R94.2 R100.2 TP90.1
NetQ47_C: Q47.C R89.2 TP82.1 U5.4(2A)
NetQ48_B: Q48.B R108.1 R110.1 TP93.1
NetQ48_C: Q48.C R94.1 R106.2 TP63.1 U5.1(1A) U5.9(3A)
NetQ49_B: Q49.B R114.1 R117.1 TP95.1
NetQ49_C: Q49.C R93.2 R107.2 TP64.1 U5.5(2B) U5.13(4B)
NetR109_2: R109.2 R115.2 TP94.1 U6.3(IN2+)
NetR115_1: R115.1 TP99.1 U6.6(-IN1) U6.7(OUT1)
NetR120_1: R120.1 R122.2 TP102.1 U7.1(OUT2)

### Notes on the sheet
- Drawn By
- File
- REV
- V00
- mc_wl.shcdoc
- Aic
- original release
- ECN List
- Product Title
- Title
- 左轮BDC驱动
- mower_bdc
- 2017-05-15
- DATA
- Approve By
- Checked By
- Data
- Product Num
- TOPBAND
- Revision
- Sheet
- 3/5
- 微电研发中心

### Library data of the parts
C25-C37 C59 = Cap(0603): Component Kind: standard; Component Type: standard
CN4 = 5Pin(2.54~7.92mm): 插座; U_TABLE: U_SAM01021601; id: 31; Part Number: 5Pin(2.54~7.92mm); Component Kind: Standard; Component Type: Standard; Designator: 5Pin(2.54~7.92mm); Pin Count: 5
D12 D13 D19 D20 = D Zener(贴片): as D3 on sheet mc_ma; Part Number: D Zener(贴片); Component Kind: standard; Component Type: standard; Pin Count: 2
D14 = Diode(TVS_贴片)_1: as D31 on sheet mower_bdc; Part Number: Diode(TVS_贴片)_1; Component Kind: standard; Component Type: standard; Pin Count: 2
D15-D18 = Diode(DO-35)-D: 二极管; U_TABLE: U_SAM010203; id: 32; Part Number: Diode(DO-35)-D; Component Kind: standard; Component Type: standard; Pin Count: 2
EC4 = Electro(2.5mm): as EC7 on sheet mower_bdc; Part Number: Electro(2.5mm); Component Kind: standard; Component Type: standard; Pin Count: 2
Q26 Q27 Q34 Q35 Q37 Q38 Q46 Q47 = NPN(贴片): 三极管; U_TABLE: U_SAM010204; id: 18; Part Number: NPN(贴片); Component Kind: standard; Component Type: standard; Pin Count: 3
Q28 Q29 = PMOS-2: MOS管; U_TABLE: U_SAM010204; id: 19; Part Number: PMOS-2; Component Kind: standard; Component Type: standard; Pin Count: 3
Q30 Q31 Q36 Q39-Q42 Q44 = NMOS-2: MOS管; U_TABLE: U_SAM010204; id: 17; Part Number: NMOS-2; Component Kind: standard; Component Type: standard; Pin Count: 3
Q32 Q33 Q43 Q45 Q48 Q49 = PNP(贴片): 三极管; U_TABLE: U_SAM010204; id: 20; Part Number: PNP(贴片); Component Kind: standard; Component Type: standard; Pin Count: 3
R69-R96 R98-R100 R102-R105 R120 = Res2: Resistor; Value: 1K; 物料编码: 150103083; Published: 8-Jun-2000; LatestRevisionDate: 17-Jul-2002; LatestRevisionNote: Re-released for DXP Platform.; PackageReference: AXIAL-0.4; Publisher: Altium Limited
R97 R101 R106-R108 R114 = Res2: Resistor; 物料编码: 150103083; Published: 8-Jun-2000; LatestRevisionDate: 17-Jul-2002; LatestRevisionNote: Re-released for DXP Platform.; PackageReference: AXIAL-0.4; Publisher: Altium Limited; Value: 1K
R109 R111 R113 R115 R118 = Res2: Resistor; Value: 1K; Published: 8-Jun-2000; LatestRevisionDate: 17-Jul-2002; LatestRevisionNote: Re-released for DXP Platform.; PackageReference: AXIAL-0.4; Publisher: Altium Limited
R110 R112 R116 R117 R119 R121-R123 R189 = Res2: Resistor; Published: 8-Jun-2000; LatestRevisionDate: 17-Jul-2002; LatestRevisionNote: Re-released for DXP Platform.; PackageReference: AXIAL-0.4; Publisher: Altium Limited
U6 = IC_LM358: as U4 on sheet mc_ma; Part Number: IC_LM358; Component Kind: standard; Component Type: standard; Designator: IC_LM358; Footprint: DIP14; Pin Count: 8; U_100076（型号）: LM358; U_100040（封装方式）: SO-8; U_100086（指定供应商）: TI
U7 = IC_LM358: 121000225; U_TABLE: U_SAM010210; Description: 集成电路; id: 83; U_ITEM_ID（物料编码）: 121000100; U_100076（型号）: LM358; U_100114（SAP物料描述）: SMT运放LM358_SO-8_TI_环保; U_100047（环保属性）: 环保; U_100107（工厂BOM使用频率）: 1000:1;1500:12;3000:7;5000:14;; U_100105（工厂库存）: 1000:7508.000;1500:160.000;2000:0.000;3000:485.000;5000:1542.000;; U_100117（工厂采购量）: 1000:7500.000;1500:300.000;3000:2500.000;5000:7500.000;; Part Number: IC_LM358; Component Kind: standard; Component Type: standard; Designator: IC_LM358; Footprint: DIP14; Pin Count: 8; U_100040（封装方式）: SO-8; U_100086（指定供应商）: TI

## Sheet mc_wr.SchDoc
size A4
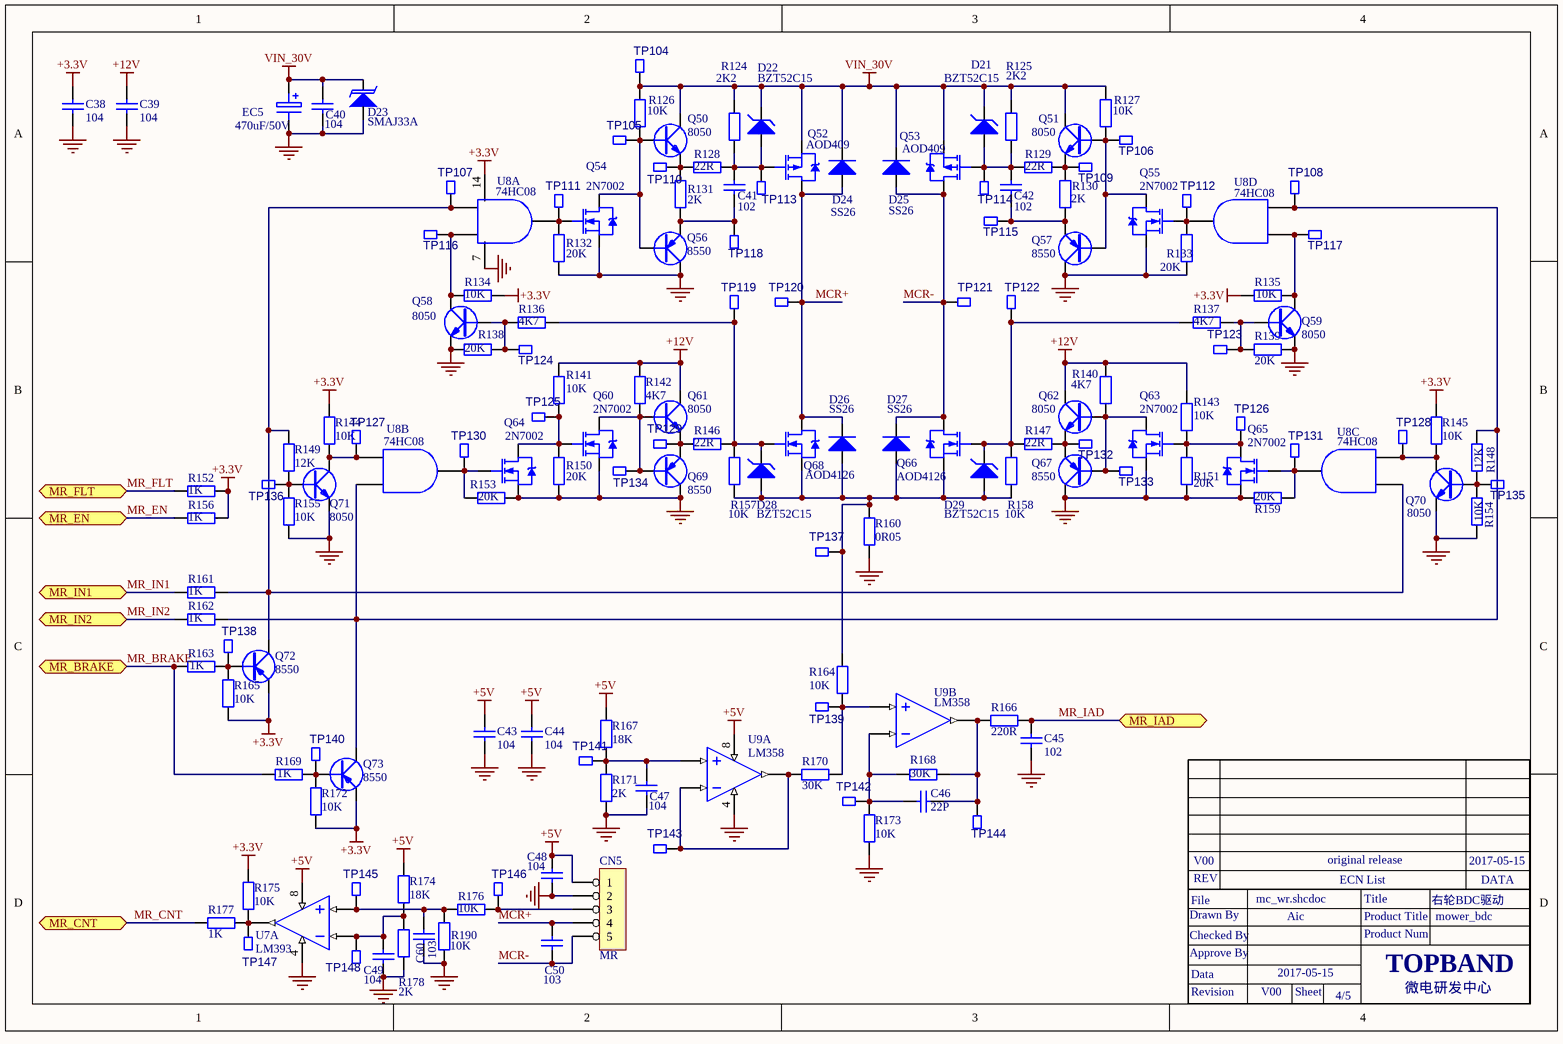
[diagram p3: mc_wr.SchDoc]

### Parts
C38  104  [0603C]
C39  104  [0603C]
C40  104  [0805C]
C41  102  [0805C]
C42  102  [0805C]
C43  104  [0603C]
C44  104  [0603C]
C45  102  [0603C]
C46  22P  [0603C]
C47  104  [0603C]
C48  104  [0603C]
C49  104  [0603C]
C50  103  [1206C]
C60  103  [0603C]
CN5  MR  [CON5-2.54]
D21  BZT52C15  [SOD-123]
D22  BZT52C15  [SOD-123]
D23  SMAJ33A  [DO-214AC]
D24  SS26  [SMB]
D25  SS26  [SMB]
D26  SS26  [SMB]
D27  SS26  [SMB]
D28  BZT52C15  [SOD-123]
D29  BZT52C15  [SOD-123]
EC5  470uF/50V  [EC12.5]
Q50  8050  [SOT-23-BCE]
Q51  8050  [SOT-23-BCE]
Q52  AOD409  [D-PACK-GDS]
Q53  AOD409  [D-PACK-GDS]
Q54  2N7002  [SOT-23-GDS]
Q55  2N7002  [SOT-23-GDS]
Q56  8550  [SOT-23-BCE]
Q57  8550  [SOT-23-BCE]
Q58  8050  [SOT-23-BCE]
Q59  8050  [SOT-23-BCE]
Q60  2N7002  [SOT-23-GDS]
Q61  8050  [SOT-23-BCE]
Q62  8050  [SOT-23-BCE]
Q63  2N7002  [SOT-23-GDS]
Q64  2N7002  [SOT-23-GDS]
Q65  2N7002  [SOT-23-GDS]
Q66  AOD4126  [D-PACK-GDS]
Q67  8550  [SOT-23-BCE]
Q68  AOD4126  [D-PACK-GDS]
Q69  8550  [SOT-23-BCE]
Q70  8050  [SOT-23-BCE]
Q71  8050  [SOT-23-BCE]
Q72  8550  [SOT-23-BCE]
Q73  8550  [SOT-23-BCE]
R124  2K2  [0805R]
R125  2K2  [0805R]
R126  10K  [0603R]
R127  10K  [0603R]
R128  22R  [0805R]
R129  22R  [0805R]
R130  2K  [0805R]
R131  2K  [0805R]
R132  20K  [0603R]
R133  20K  [0603R]
R134  10K  [0603R]
R135  10K  [0603R]
R136  4K7  [0603R]
R137  4K7  [0603R]
R138  20K  [0603R]
R139  20K  [0603R]
R140  4K7  [0603R]
R141  10K  [0603R]
R142  4K7  [0603R]
R143  10K  [0603R]
R144  10K  [0603R]
R145  10K  [0603R]
R146  22R  [0805R]
R147  22R  [0805R]
R148  12K  [0603R]
R149  12K  [0603R]
R150  20K  [0603R]
R151  20K  [0603R]
R152  1K  [0603R]
R153  20K  [0603R]
R154  10K  [0603R]
R155  10K  [0603R]
R156  1K  [0603R]
R157  10K  [0603R]
R158  10K  [0603R]
R159  20K  [0603R]
R160  0R05  [2512R]
R161  1K  [0603R]
R162  1K  [0603R]
R163  1K  [0603R]
R164  10K  [0603R]
R165  10K  [0603R]
R166  220R  [0603R]
R167  18K  [0603R]
R168  30K  [0603R]
R169  1K  [0603R]
R170  30K  [0603R]
R171  2K  [0603R]
R172  10K  [0603R]
R173  10K  [0603R]
R174  18K  [0603R]
R175  10K  [0603R]
R176  10K  [0603R]
R177  1K  [0603R]
R178  2K  [0603R]
R190  10K  [0603R]
TP104  TP  [TEST-0.8MM]  (value not drawn)
TP105  TP  [TEST-0.8MM]  (value not drawn)
TP106  TP  [TEST-0.8MM]  (value not drawn)
TP107  TP  [TEST-0.8MM]  (value not drawn)
TP108  TP  [TEST-0.8MM]  (value not drawn)
TP109  TP  [TEST-0.8MM]  (value not drawn)
TP110  TP  [TEST-0.8MM]  (value not drawn)
TP111  TP  [TEST-0.8MM]  (value not drawn)
TP112  TP  [TEST-0.8MM]  (value not drawn)
TP113  TP  [TEST-0.8MM]  (value not drawn)
TP114  TP  [TEST-0.8MM]  (value not drawn)
TP115  TP  [TEST-0.8MM]  (value not drawn)
TP116  TP  [TEST-0.8MM]  (value not drawn)
TP117  TP  [TEST-0.8MM]  (value not drawn)
TP118  TP  [TEST-0.8MM]  (value not drawn)
TP119  TP  [TEST-0.8MM]  (value not drawn)
TP120  TP  [TEST-0.8MM]  (value not drawn)
TP121  TP  [TEST-0.8MM]  (value not drawn)
TP122  TP  [TEST-0.8MM]  (value not drawn)
TP123  TP  [TEST-0.8MM]  (value not drawn)
TP124  TP  [TEST-0.8MM]  (value not drawn)
TP125  TP  [TEST-0.8MM]  (value not drawn)
TP126  TP  [TEST-0.8MM]  (value not drawn)
TP127  TP  [TEST-0.8MM]  (value not drawn)
TP128  TP  [TEST-0.8MM]  (value not drawn)
TP129  TP  [TEST-0.8MM]  (value not drawn)
TP130  TP  [TEST-0.8MM]  (value not drawn)
TP131  TP  [TEST-0.8MM]  (value not drawn)
TP132  TP  [TEST-0.8MM]  (value not drawn)
TP133  TP  [TEST-0.8MM]  (value not drawn)
TP134  TP  [TEST-0.8MM]  (value not drawn)
TP135  TP  [TEST-0.8MM]  (value not drawn)
TP136  TP  [TEST-0.8MM]  (value not drawn)
TP137  TP  [TEST-0.8MM]  (value not drawn)
TP138  TP  [TEST-0.8MM]  (value not drawn)
TP139  TP  [TEST-0.8MM]  (value not drawn)
TP140  TP  [TEST-0.8MM]  (value not drawn)
TP141  TP  [TEST-0.8MM]  (value not drawn)
TP142  TP  [TEST-0.8MM]  (value not drawn)
TP143  TP  [TEST-0.8MM]  (value not drawn)
TP144  TP  [TEST-0.8MM]  (value not drawn)
TP145  TP  [TEST-0.8MM]  (value not drawn)
TP146  TP  [TEST-0.8MM]  (value not drawn)
TP147  TP  [TEST-0.8MM]  (value not drawn)
TP148  TP  [TEST-0.8MM]  (value not drawn)
U7  LM393  [SO-8]  (part A of 2)
U8  74HC08  [SO-14]  (parts A,B,C,D of 4)
U9  LM358  [SO-8]  (parts A,B of 2)

### Ports
MR_BRAKE, MR_CNT, MR_EN, MR_FLT, MR_IAD, MR_IN1, MR_IN2

### Nets
+3.3V: C38.2 Q72.E Q73.E R134.2 R135.1 R144.1 R145.2 R152.2 R156.2 R165.2 R172.2 R175.2 U8.14(VCC)
+5V: C43.2 C44.2 C48.2 CN5.1 R167.2 R174.2 U7.8(VCC) U9.8(VCC)
+12V: C38.1 C39.1 C39.2 C40.1 C43.1 C44.1 C45.2 C47.1 C48.1 C49.1 C60.1 CN5.2 D23.A EC5.2 Q54.S Q55.S Q56.C Q57.C Q58.E Q59.E Q60.S Q61.C Q62.C Q63.S Q64.S Q65.S Q67.C Q69.C Q70.E Q71.E R132.2 R133.1 R138.1 R139.2 R140.1 R141.2 R142.2 R143.2 R150.2 R151.2 R153.2 R154.1 R155.1 R159.1 R160.1 R171.1 R173.1 R178.1 R190.2 U7.4(GND) U8.7(GND) U9.4(GND)  [also labelled GND]
VIN_30V: C40.2 D21.K D22.K D23.K D24.K D25.K EC5.1 Q50.C Q51.C Q52.S Q53.S R124.1 R125.1 R126.1 R127.1 TP104.1
MCR+: C50.2 CN5.4 D24.A D26.K Q52.D Q68.D TP120.1
MCR-: C50.1 CN5.5 D25.A D27.K Q53.D Q66.D TP121.1
MR_BRAKE: R163.2 R169.2 ; port MR_BRAKE
MR_CNT: R177.1 ; port MR_CNT
MR_EN: R156.1 ; port MR_EN
MR_FLT: R152.1 ; port MR_FLT
MR_IAD: C45.1 R166.2 ; port MR_IAD
MR_IN1: R161.1 ; port MR_IN1
MR_IN2: R162.1 ; port MR_IN2
NetC41_1: C41.1 D22.A Q52.G R124.2 R128.2 TP113.1
NetC41_2: C41.2 Q56.E R131.2 TP118.1
NetC42_1: C42.1 D21.A Q53.G R125.2 R129.1 TP114.1
NetC42_2: C42.2 Q57.E R130.2 TP115.1
NetC46_1: C46.1 R166.1 R168.1 TP144.1 U9.1(OUT2)
NetC46_2: C46.2 R168.2 R173.2 TP142.1 U9.2(-IN2)
NetC47_2: C47.2 R167.1 R171.2 TP141.1 U9.5(+IN1)
NetC49_2: C49.2 R174.1 R178.2 TP148.1 U7.6(-IN1)
NetC60_2: C60.2 R176.2 R190.1 TP145.1 U7.5(+IN1)
NetCN5_3: CN5.3 R176.1 TP146.1
NetD26_A: D26.A D27.A D28.A D29.A Q66.S Q68.S R157.1 R158.1 R160.2 R164.1 TP137.1
NetD28_K: D28.K Q68.G R136.2 R146.2 R157.2 TP119.1
NetD29_K: D29.K Q66.G R137.1 R147.1 R158.2 TP122.1
NetQ50_B: Q50.B Q54.D Q56.B R126.2 TP105.1
NetQ50_E: Q50.E R128.1 R131.1 TP110.1
NetQ51_B: Q51.B Q55.D Q57.B R127.2 TP106.1
NetQ51_E: Q51.E R129.2 R130.1 TP109.1
NetQ54_G: Q54.G R132.1 TP111.1 U8.3(1Y)
NetQ55_G: Q55.G R133.2 TP112.1 U8.11(4Y)
NetQ58_B: Q58.B R136.1 R138.2 TP124.1
NetQ58_C: Q58.C R134.1 TP116.1 U8.2(1B)
NetQ59_B: Q59.B R137.2 R139.1 TP123.1
NetQ59_C: Q59.C R135.2 TP117.1 U8.12(4A)
NetQ60_D: Q60.D Q61.B Q69.B R142.1 TP134.1
NetQ60_G: Q60.G Q64.D R141.1 R150.1 TP125.1
NetQ61_E: Q61.E Q69.E R146.1 TP129.1
NetQ62_B: Q62.B Q63.D Q67.B R140.2 TP133.1
NetQ62_E: Q62.E Q67.E R147.2 TP132.1
NetQ63_G: Q63.G Q65.D R143.1 R151.1 TP126.1
NetQ64_G: Q64.G R153.1 TP130.1 U8.6(2Y)
NetQ65_G: Q65.G R159.2 TP131.1 U8.8(3Y)
NetQ70_B: Q70.B R148.1 R154.2 TP135.1
NetQ70_C: Q70.C R145.1 TP128.1 U8.10(3B)
NetQ71_B: Q71.B R149.2 R155.2 TP136.1
NetQ71_C: Q71.C R144.2 TP127.1 U8.4(2A)
NetQ72_B: Q72.B R163.1 R165.1 TP138.1
NetQ72_C: Q72.C R149.1 R161.2 TP107.1 U8.1(1A) U8.9(3A)
NetQ73_B: Q73.B R169.1 R172.1 TP140.1
NetQ73_C: Q73.C R148.2 R162.2 TP108.1 U8.5(2B) U8.13(4B)
NetR164_2: R164.2 R170.2 TP139.1 U9.3(IN2+)
NetR170_1: R170.1 TP143.1 U9.6(-IN1) U9.7(OUT1)
NetR175_1: R175.1 R177.2 TP147.1 U7.7(OUT1)

### Notes on the sheet
- Drawn By
- File
- REV
- V00
- mc_wr.shcdoc
- Aic
- original release
- ECN List
- Product Title
- Title
- 右轮BDC驱动
- mower_bdc
- 2017-05-15
- DATA
- Approve By
- Checked By
- Data
- Product Num
- TOPBAND
- Revision
- Sheet
- 4/5
- 微电研发中心

### Library data of the parts
C38-C50 C60 = Cap(0603): Component Kind: standard; Component Type: standard
CN5 = 5Pin(2.54~7.92mm): 插座; U_TABLE: U_SAM01021601; id: 31; Part Number: 5Pin(2.54~7.92mm); Component Kind: Standard; Component Type: Standard; Designator: 5Pin(2.54~7.92mm); Pin Count: 5
D21 D22 D28 D29 = D Zener(贴片): as D3 on sheet mc_ma; Part Number: D Zener(贴片); Component Kind: standard; Component Type: standard; Pin Count: 2
D23 = Diode(TVS_贴片)_1: as D31 on sheet mower_bdc; Part Number: Diode(TVS_贴片)_1; Component Kind: standard; Component Type: standard; Pin Count: 2
D24-D27 = Diode(DO-35)-D: 二极管; U_TABLE: U_SAM010203; id: 32; Part Number: Diode(DO-35)-D; Component Kind: standard; Component Type: standard; Pin Count: 2
EC5 = Electro(2.5mm): as EC7 on sheet mower_bdc; Part Number: Electro(2.5mm); Component Kind: standard; Component Type: standard; Pin Count: 2
Q50 Q51 Q58 Q59 Q61 Q62 Q70 Q71 = NPN(贴片): 三极管; U_TABLE: U_SAM010204; id: 18; Part Number: NPN(贴片); Component Kind: standard; Component Type: standard; Pin Count: 3
Q52 Q53 = PMOS-2: MOS管; U_TABLE: U_SAM010204; id: 19; Part Number: PMOS-2; Component Kind: standard; Component Type: standard; Pin Count: 3
Q54 Q55 Q60 Q63-Q66 Q68 = NMOS-2: MOS管; U_TABLE: U_SAM010204; id: 17; Part Number: NMOS-2; Component Kind: standard; Component Type: standard; Pin Count: 3
Q56 Q57 Q67 Q69 Q72 Q73 = PNP(贴片): 三极管; U_TABLE: U_SAM010204; id: 20; Part Number: PNP(贴片); Component Kind: standard; Component Type: standard; Pin Count: 3
R124-R151 R153-R155 R157-R160 R175 = Res2: Resistor; Value: 1K; 物料编码: 150103083; Published: 8-Jun-2000; LatestRevisionDate: 17-Jul-2002; LatestRevisionNote: Re-released for DXP Platform.; PackageReference: AXIAL-0.4; Publisher: Altium Limited
R152 R156 R161-R163 R169 = Res2: Resistor; 物料编码: 150103083; Published: 8-Jun-2000; LatestRevisionDate: 17-Jul-2002; LatestRevisionNote: Re-released for DXP Platform.; PackageReference: AXIAL-0.4; Publisher: Altium Limited; Value: 1K
R164 R166 R168 R170 R173 = Res2: Resistor; Value: 1K; Published: 8-Jun-2000; LatestRevisionDate: 17-Jul-2002; LatestRevisionNote: Re-released for DXP Platform.; PackageReference: AXIAL-0.4; Publisher: Altium Limited
R165 R167 R171 R172 R174 R176-R178 R190 = Res2: Resistor; Published: 8-Jun-2000; LatestRevisionDate: 17-Jul-2002; LatestRevisionNote: Re-released for DXP Platform.; PackageReference: AXIAL-0.4; Publisher: Altium Limited
U7 = IC_LM358: as U7 on sheet mc_wl; Part Number: IC_LM358; Component Kind: standard; Component Type: standard; Designator: IC_LM358; Footprint: DIP14; Pin Count: 8; U_100040（封装方式）: SO-8; U_100086（指定供应商）: TI
U9 = IC_LM358: as U4 on sheet mc_ma; Part Number: IC_LM358; Component Kind: standard; Component Type: standard; Designator: IC_LM358; Footprint: DIP14; Pin Count: 8; U_100076（型号）: LM358; U_100040（封装方式）: SO-8; U_100086（指定供应商）: TI

## Sheet mc_ds.SchDoc
size A4
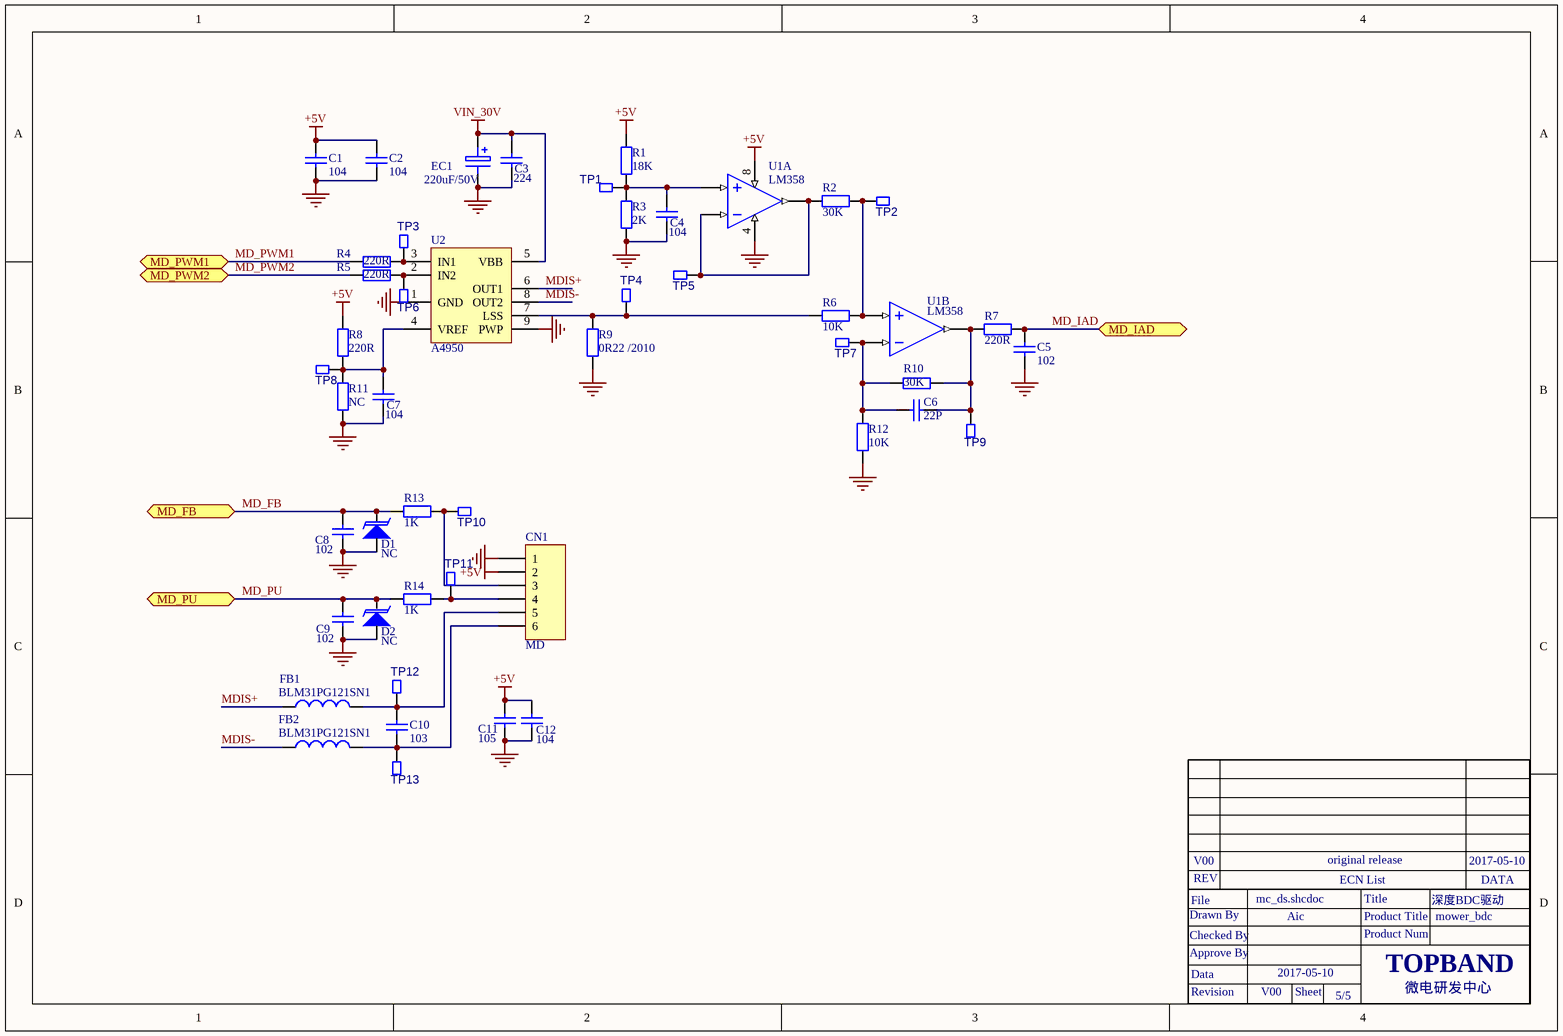
[diagram p4: mc_ds.SchDoc]

### Parts
C1  104  [0603C]
C2  104  [0603C]
C3  224  [0805C]
C4  104  [0603C]
C5  102  [0603C]
C6  22P  [0603C]
C7  104  [0603C]
C8  102  [0603C]
C9  102  [0603C]
C10  103  [0805C]
C11  105  [0805C]
C12  104  [0603C]
CN1  MD  [CON6-2.54]
D1  NC  [SOD-123]
D2  NC  [SOD-123]
EC1  220uF/50V  [EC10]
FB1  BLM31PG121SN1  [1206R]
FB2  BLM31PG121SN1  [1206R]
R1  18K  [0603R]
R2  30K  [0603R]
R3  2K  [0603R]
R4  220R  [0603R]
R5  220R  [0603R]
R6  10K  [0603R]
R7  220R  [0603R]
R8  220R  [0603R]
R9  0R22 /2010  [2010R]
R10  30K  [0603R]
R11  NC  [0603R]
R12  10K  [0603R]
R13  1K  [0603R]
R14  1K  [0603R]
TP1  TP  [TEST-0.8MM]  (value not drawn)
TP2  TP  [TEST-0.8MM]  (value not drawn)
TP3  TP  [TEST-0.8MM]  (value not drawn)
TP4  TP  [TEST-0.8MM]  (value not drawn)
TP5  TP  [TEST-0.8MM]  (value not drawn)
TP6  TP  [TEST-0.8MM]  (value not drawn)
TP7  TP  [TEST-0.8MM]  (value not drawn)
TP8  TP  [TEST-0.8MM]  (value not drawn)
TP9  TP  [TEST-0.8MM]  (value not drawn)
TP10  TP  [TEST-0.8MM]  (value not drawn)
TP11  TP  [TEST-0.8MM]  (value not drawn)
TP12  TP  [TEST-0.8MM]  (value not drawn)
TP13  TP  [TEST-0.8MM]  (value not drawn)
U1  LM358  [SO-8]  (parts A,B of 2)
U2  A4950  [SO-8 - E]

### Ports
MD_FB, MD_IAD, MD_PU, MD_PWM1, MD_PWM2

### Nets
+5V: C1.2 C2.2 C11.1 C12.1 CN1.2 R1.2 R8.1 U1.8(VCC)
GND: C1.1 C2.1 C3.1 C4.1 C5.2 C7.1 C8.2 C9.2 C11.2 C12.2 CN1.1 D1.A D2.A EC1.2 R3.1 R9.2 R11.1 R12.1 U1.4(GND) U2.1(GND) U2.9(PWP)  [project net +12V]
VIN_30V: C3.2 EC1.1 U2.5(VBB)
MD_FB: C8.1 D1.K R13.2 ; port MD_FB
MD_IAD: C5.1 R7.2 ; port MD_IAD
MD_PU: C9.1 D2.K R14.2 ; port MD_PU
MD_PWM1: R4.1 ; port MD_PWM1
MD_PWM2: R5.1 ; port MD_PWM2
MDIS+: FB1.1 U2.6(OUT1)
MDIS-: FB2.1 U2.8(OUT2)
NetC4_2: C4.2 R1.1 R3.2 TP1.1 U1.5(+IN1)
NetC6_1: C6.1 R7.1 R10.1 TP9.1 U1.1(OUT2)
NetC6_2: C6.2 R10.2 R12.2 TP7.1 U1.2(-IN2)
NetC7_2: C7.2 R8.2 R11.2 TP8.1 U2.4(VREF)
NetC10_1: C10.1 CN1.5 FB1.2 TP12.1
NetC10_2: C10.2 CN1.6 FB2.2 TP13.1
NetCN1_3: CN1.3 R13.1 TP10.1
NetCN1_4: CN1.4 R14.1 TP11.1
NetR2_1: R2.1 TP5.1 U1.6(-IN1) U1.7(OUT1)
NetR2_2: R2.2 R6.2 TP2.1 U1.3(IN2+)
NetR4_2: R4.2 TP3.1 U2.3(IN1)
NetR5_2: R5.2 TP6.1 U2.2(IN2)
NetR6_1: R6.1 R9.1 TP4.1 U2.7(LSS)

### Notes on the sheet
- Drawn By
- File
- REV
- V00
- mc_ds.shcdoc
- Aic
- original release
- ECN List
- Product Title
- Title
- 深度BDC驱动
- mower_bdc
- 2017-05-10
- DATA
- Approve By
- Checked By
- Data
- Product Num
- TOPBAND
- Revision
- Sheet
- 5/5
- 微电研发中心

### Library data of the parts
C1-C12 = Cap(0603): Component Kind: standard; Component Type: standard
CN1 = Header 6: Header, 6-Pin; LatestRevisionDate: 17-Jul-2002; LatestRevisionNote: Re-released for DXP Platform.; Publisher: Altium Limited
D1 D2 = Diode(TVS_贴片)_1: TVS管; U_TABLE: U_SAM010203; id: 28; Part Number: Diode(TVS_贴片)_1; Component Kind: standard; Component Type: standard; Pin Count: 2
EC1 = Electro(2.5mm): 120202468; U_TABLE: U_SAM010202; id: 42; Description: 电解电容; Part Number: Electro(2.5mm); Component Kind: standard; Component Type: standard; Pin Count: 2
FB1 FB2 = Inductor: 电感; U_TABLE: U_SAM010207; id: 53; Part Number: Inductor; Component Kind: Standard; Component Type: Standard; Pin Count: 2
R1 R3 R13 R14 = Res2: Resistor; Published: 8-Jun-2000; LatestRevisionDate: 17-Jul-2002; LatestRevisionNote: Re-released for DXP Platform.; PackageReference: AXIAL-0.4; Publisher: Altium Limited
  R13 R14: Value: 1K
R2 R4-R8 R10-R12 = Res2: Resistor; Value: 1K; Published: 8-Jun-2000; LatestRevisionDate: 17-Jul-2002; LatestRevisionNote: Re-released for DXP Platform.; PackageReference: AXIAL-0.4; Publisher: Altium Limited
R9 = Res2: Resistor; Value: 1K; 物料编码: 150103083; Published: 8-Jun-2000; LatestRevisionDate: 17-Jul-2002; LatestRevisionNote: Re-released for DXP Platform.; PackageReference: AXIAL-0.4; Publisher: Altium Limited
U1 = IC_LM358: as U4 on sheet mc_ma; Part Number: IC_LM358; Component Kind: standard; Component Type: standard; Designator: IC_LM358; Footprint: DIP14; Pin Count: 8; U_100076（型号）: LM358; U_100040（封装方式）: SO-8; U_100086（指定供应商）: TI

## Nets that join several sheets
+3.3V: mower_bdc (C57.1 EC10.1 TP171.1 U12.2), mc_ma (13 pins), mc_wl (13 pins), mc_wr (13 pins)
+5V: mower_bdc (5 pins), mc_ma (6 pins), mc_wl (7 pins), mc_wr (8 pins), mc_ds (8 pins)
+12V: mower_bdc (32 pins), mc_ma (51 pins), mc_wl (51 pins), mc_wr (52 pins), mc_ds (21 pins)
VIN_30V: mower_bdc (8 pins), mc_ma (17 pins), mc_wl (16 pins), mc_wr (16 pins), mc_ds (C3.2 EC1.1 U2.5)
MA_BRAKE: mower_bdc (CN7.1 TP164.1), mc_ma (R54.2 R60.2)
MA_CNT: mower_bdc (CN7.5 TP168.1), mc_ma (R66.1)
MA_EN: mower_bdc (CN7.2 TP165.1), mc_ma (R47.1)
MA_FLT: mower_bdc (CN7.6 TP169.1), mc_ma (R43.1)
MA_IAD: mower_bdc (CN7.7 TP172.1), mc_ma (C21.1 R57.2)
MA_IN1: mower_bdc (CN7.3 TP166.1), mc_ma (R52.1)
MA_IN2: mower_bdc (CN7.4 TP167.1), mc_ma (R53.1)
MD_FB: mower_bdc (CN7.26 TP191.1), mc_ds (C8.1 D1.K R13.2)
MD_IAD: mower_bdc (CN7.24 TP189.1), mc_ds (C5.1 R7.2)
MD_PU: mower_bdc (CN7.25 TP190.1), mc_ds (C9.1 D2.K R14.2)
MD_PWM1: mower_bdc (CN7.22 TP187.1), mc_ds (R4.1)
MD_PWM2: mower_bdc (CN7.23 TP188.1), mc_ds (R5.1)
ML_BRAKE: mower_bdc (CN7.8 TP173.1), mc_wl (R108.2 R114.2)
ML_CNT: mower_bdc (CN7.12 TP177.1), mc_wl (R122.1)
ML_EN: mower_bdc (CN7.9 TP174.1), mc_wl (R101.1)
ML_FLT: mower_bdc (CN7.13 TP178.1), mc_wl (R97.1)
ML_IAD: mower_bdc (CN7.14 TP179.1), mc_wl (C32.1 R111.2)
ML_IN1: mower_bdc (CN7.10 TP175.1), mc_wl (R106.1)
ML_IN2: mower_bdc (CN7.11 TP176.1), mc_wl (R107.1)
MR_BRAKE: mower_bdc (CN7.15 TP180.1), mc_wr (R163.2 R169.2)
MR_CNT: mower_bdc (CN7.19 TP184.1), mc_wr (R177.1)
MR_EN: mower_bdc (CN7.16 TP181.1), mc_wr (R156.1)
MR_FLT: mower_bdc (CN7.20 TP185.1), mc_wr (R152.1)
MR_IAD: mower_bdc (CN7.21 TP186.1), mc_wr (C45.1 R166.2)
MR_IN1: mower_bdc (CN7.17 TP182.1), mc_wr (R161.1)
MR_IN2: mower_bdc (CN7.18 TP183.1), mc_wr (R162.1)